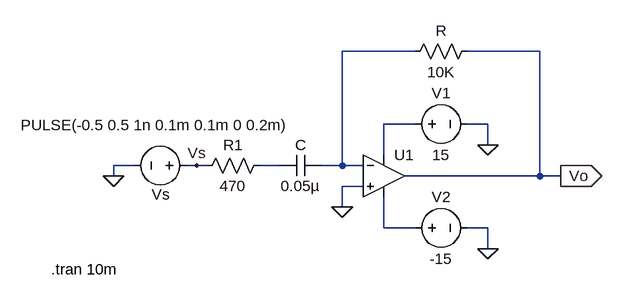
[diagram p0: schematic Run_3.asc]
Run_3.asc, the LTspice schematic file:
Version 4
SHEET 1 880 680
WIRE -160 0 -272 0
WIRE 32 0 -80 0
WIRE -160 112 -208 112
WIRE -48 112 -80 112
WIRE -48 144 -48 112
WIRE -208 160 -208 112
WIRE -592 176 -624 176
WIRE -496 176 -512 176
WIRE -480 176 -496 176
WIRE -368 176 -400 176
WIRE -272 176 -272 0
WIRE -272 176 -304 176
WIRE -240 176 -272 176
WIRE -624 192 -624 176
WIRE 32 192 32 0
WIRE 32 192 -176 192
WIRE 64 192 32 192
WIRE -240 208 -272 208
WIRE -272 240 -272 208
WIRE -208 272 -208 224
WIRE -160 272 -208 272
WIRE -48 272 -80 272
WIRE -48 304 -48 272
FLAG -48 144 0
FLAG -48 304 0
FLAG -272 240 0
FLAG -624 192 0
FLAG -496 176 Vs
FLAG 64 192 Vo
IOPIN 64 192 Out
SYMBOL OpAmps\\UniversalOpamp2 -208 192 R0
SYMATTR InstName U1
SYMBOL voltage -176 112 R270
WINDOW 0 32 56 VTop 2
WINDOW 3 -32 56 VBottom 2
WINDOW 123 0 0 Left 0
WINDOW 39 0 0 Left 0
SYMATTR InstName V1
SYMATTR Value 15
SYMBOL voltage -176 272 R270
WINDOW 0 32 56 VTop 2
WINDOW 3 -32 56 VBottom 2
WINDOW 123 0 0 Left 0
WINDOW 39 0 0 Left 0
SYMATTR InstName V2
SYMATTR Value -15
SYMBOL cap -304 160 R90
WINDOW 0 0 32 VBottom 2
WINDOW 3 32 32 VTop 2
SYMATTR InstName C
SYMATTR Value 0.05µ
SYMBOL res -64 -16 R90
WINDOW 0 0 56 VBottom 2
WINDOW 3 32 56 VTop 2
SYMATTR InstName R
SYMATTR Value 10K
SYMBOL res -384 160 R90
WINDOW 0 0 56 VBottom 2
WINDOW 3 32 56 VTop 2
SYMATTR InstName R1
SYMATTR Value 470
SYMBOL voltage -496 176 R90
WINDOW 0 60 55 VBottom 2
WINDOW 3 -78 64 VTop 2
WINDOW 123 0 0 Left 0
WINDOW 39 0 0 Left 0
SYMATTR InstName Vs
SYMATTR Value PULSE(-0.5 0.5 1n 0.1m 0.1m 0 0.2m)
TEXT -720 336 Left 2 !.tran 10m

The netlist it stands for:
* Run_3.asc
XU1 0 N001 N002 N004 Vo level.2 Avol=1Meg GBW=10Meg Slew=10Meg ilimit=25m rail=0 Vos=0 phimargin=45 en=0 enk=0 in=0 ink=0 Rin=500Meg  ; pins IN+ IN- V+ V- OUT
V1 N002 0 15
V2 N004 0 -15
C N001 N003 0.05µ
R Vo N001 10K
R1 N003 Vs 470
Vs Vs 0 PULSE(-0.5 0.5 1n 0.1m 0.1m 0 0.2m)
.tran 10m
.lib UniversalOpamps2.sub
.backanno
.end